# Altium project sensors_0v3.PrjPCB
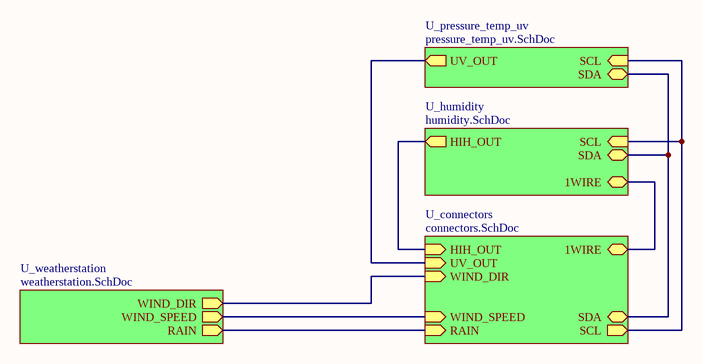
[diagram p0: main.SchDoc]
5 sheets, 69 parts. Net scope: hierarchical (ports join the sheet entries above them; power ports are global).
Board file: sensors_0v3.PcbDoc
Sheets:
  main.SchDoc
    U_connectors = connectors.SchDoc
    U_humidity = humidity.SchDoc
    U_pressure_temp_uv = pressure_temp_uv.SchDoc
    U_weatherstation = weatherstation.SchDoc

## Sheet main.SchDoc
size A4

### Sub-sheets
U_connectors = connectors.SchDoc: WIND_DIR (in), UV_OUT (in), HIH_OUT (in), WIND_SPEED (in), RAIN (in), SCL (out), SDA (bidir), 1WIRE (bidir)
U_humidity = humidity.SchDoc: HIH_OUT (out), SCL (in), SDA (bidir), 1WIRE (bidir)
U_pressure_temp_uv = pressure_temp_uv.SchDoc: UV_OUT (out), SCL (in), SDA (bidir)
U_weatherstation = weatherstation.SchDoc: RAIN (out), WIND_DIR (out), WIND_SPEED (out)

### Nets
1WIRE: sheet U_connectors/1WIRE, sheet U_humidity/1WIRE
SCL: sheet U_connectors/SCL, sheet U_humidity/SCL, sheet U_pressure_temp_uv/SCL
SDA: sheet U_connectors/SDA, sheet U_humidity/SDA, sheet U_pressure_temp_uv/SDA
NetC4_2: sheet U_connectors/HIH_OUT, sheet U_humidity/HIH_OUT
NetC12_2: sheet U_connectors/UV_OUT, sheet U_pressure_temp_uv/UV_OUT
NetC19_2: sheet U_connectors/RAIN, sheet U_weatherstation/RAIN
NetC20_2: sheet U_connectors/WIND_SPEED, sheet U_weatherstation/WIND_SPEED
NetC24_2: sheet U_connectors/WIND_DIR, sheet U_weatherstation/WIND_DIR

### Notes on the sheet
- Title
- Size:
- Date:
- A4
- Number:
- Time:
- Revision:
- Sheet
- of
- File:

## Sheet connectors.SchDoc
size A4
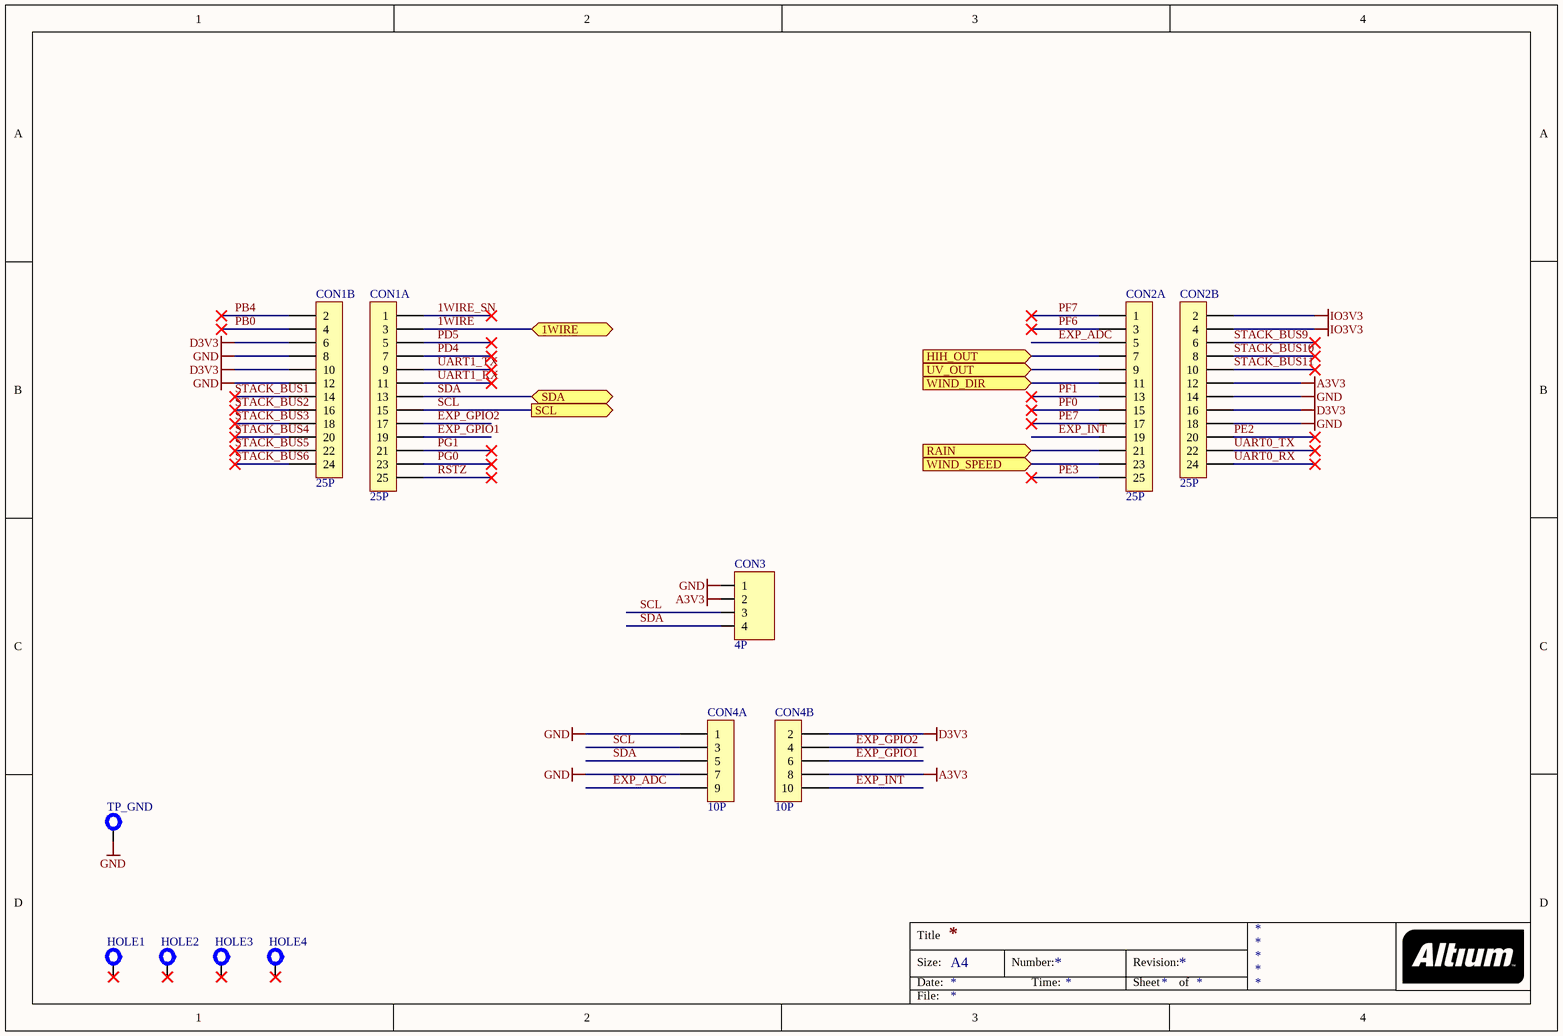
[diagram p1: connectors.SchDoc]

### Parts
CON1  25P  [DF9-25-STACK]  (parts A,B of 2)
CON2  25P  [DF9-25-STACK]  (parts A,B of 2)
CON3  4P  [SIP-4]
CON4  10P  [IDC-10]  (parts A,B of 2)
HOLE1  HOLE  [NPTH-3MM]  (value not drawn)  (no BOM)
HOLE2  HOLE  [NPTH-3MM]  (value not drawn)  (no BOM)
HOLE3  HOLE  [NPTH-3MM]  (value not drawn)  (no BOM)
HOLE4  HOLE  [NPTH-3MM]  (value not drawn)  (no BOM)
TP_GND  Test Point  [TEST-PROBE2]  (value not drawn)  (no BOM)

### Ports
1WIRE (bidir), HIH_OUT (in), RAIN (in), SCL (out), SDA (bidir), UV_OUT (in), WIND_DIR (in), WIND_SPEED (in)

### Nets
A3V3: CON2.12 CON3.2 CON4.8
D3V3: CON1.6 CON1.10 CON2.16 CON4.2
GND: CON1.8 CON1.12 CON2.14 CON2.18 CON3.1 CON4.1 CON4.7 TP_GND.1(TP)
IO3V3: CON2.2 CON2.4
1WIRE: CON1.3 ; port 1WIRE
1WIRE_SN: CON1.1
EXP_ADC: CON2.5 CON4.9
EXP_GPIO1: CON1.19 CON4.6
EXP_GPIO2: CON1.17 CON4.4
EXP_INT: CON2.19 CON4.10
PB0: CON1.4
PB4: CON1.2
PD4: CON1.7
PD5: CON1.5
PE2: CON2.20
PE3: CON2.25
PE7: CON2.17
PF0: CON2.15
PF1: CON2.13
PF6: CON2.3
PF7: CON2.1
PG0: CON1.23
PG1: CON1.21
RSTZ: CON1.25
SCL: CON1.15 CON3.3 CON4.3 ; port SCL
SDA: CON1.13 CON3.4 CON4.5 ; port SDA
STACK_BUS1: CON1.14
STACK_BUS2: CON1.16
STACK_BUS3: CON1.18
STACK_BUS4: CON1.20
STACK_BUS5: CON1.22
STACK_BUS6: CON1.24
STACK_BUS9: CON2.6
STACK_BUS10: CON2.8
STACK_BUS11: CON2.10
UART0_RX: CON2.24
UART0_TX: CON2.22
UART1_RX: CON1.11
UART1_TX: CON1.9
NetC4_2: CON2.7 ; port HIH_OUT
NetC12_2: CON2.9 ; port UV_OUT
NetC19_2: CON2.21 ; port RAIN
NetC20_2: CON2.23 ; port WIND_SPEED
NetC24_2: CON2.11 ; port WIND_DIR

Not connected (* = marked no-connect by the designer): HOLE1 1(TP)*; HOLE2 1(TP)*; HOLE3 1(TP)*; HOLE4 1(TP)*

### Notes on the sheet
- Title
- Size:
- Date:
- A4
- Number:
- Time:
- Revision:
- Sheet
- of
- File:

### Library data of the parts
CON1 CON2 = CON25: Connector 25 Pins; Owner: Ricardo Rodrigues; Assembly: INS; Sub-Type: Connector; Creation Date: 2013-01-13; Status: Valid; Validation Date: 2012-01-13; Type: Electrical & Mechanical
CON3 = CON04: Connector 4 pins; Owner: Rui Rebelo; Assembly: INS; Sub-Type: Connector; Creation Date: 2005-10-17; Status: Valid; Validation Date: 2006-05-15; Type: Electrical & Mechanical
CON4 = CON10: Connector 10 Pins; Owner: António Silva; Assembly: INS; Sub-Type: Connector; Creation Date: 2005-11-21; Status: Valid; Validation Date: 2006-05-15; Type: Electrical & Mechanical
HOLE1-HOLE4 = PCB HOLE: PCB Fixation Hole M3; Owner: Nuno Brum; Sub-Type: Mechanical; Type: PCB; Creation Date: 2005-06-01; Status: Valid; Validation Date: 2006-05-15; Assembly: PCB
TP_GND = TEST-PROBE: Test/Probe Point; Owner: Nuno Brum; Sub-Type: Mechanical; Assembly: PCB; Validation Date: 2006-05-15; Type: PCB; Creation Date: 2005-06-01; Status: Valid

## Sheet humidity.SchDoc: Humidity Sensors
size A4; CheckedBy: rrodrigu; Author: Satxo; CompanyName: Satxo; Revision: 0v1; SheetNumber: 4; SheetTotal: 8; ProjectName: Basestation
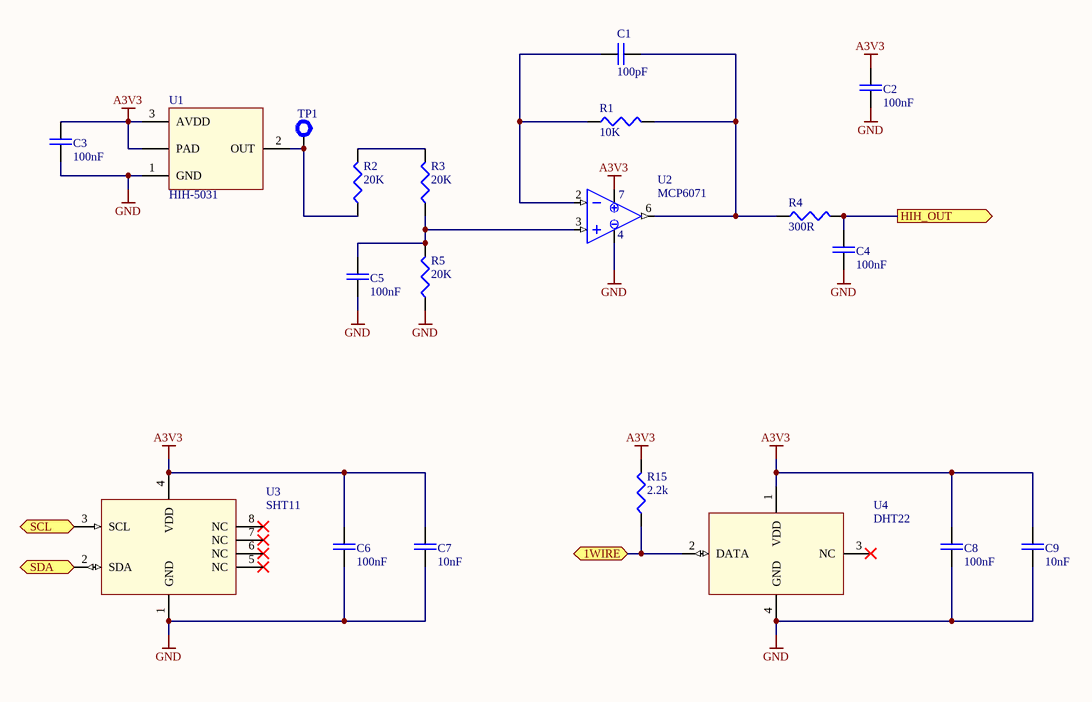
[diagram p2: humidity.SchDoc]

### Parts
C1  100pF  [0603]
C2  100nF  [0603]
C3  100nF  [0603]
C4  100nF  [0603]
C5  100nF  [0603]
C6  100nF  [0603]
C7  10nF  [0603]
C8  100nF  [0603]
C9  10nF  [0603]
R1  10K  [0603]
R2  20K  [0603]
R3  20K  [0603]
R4  300R  [0603]
R5  20K  [0603]
R15  2.2k  [0603]
TP1  Test Point  [TERMINAL]  (value not drawn)  (no BOM)
U1  HIH-5031  [HIH]
U2  MCP6071  [SOIC-8]
U3  SHT11  [SHT]
U4  DHT22  [DHT22]

### Ports
1WIRE (bidir), HIH_OUT (out), SCL (in), SDA (bidir)

### Nets
A3V3: C2.2 C3.2 C6.2 C7.2 C8.2 C9.2 R15.2 U1.3(AVDD) U1.PAD U2.7(VDD) U3.4(VDD) U4.1(VDD)
GND: C2.1 C3.1 C4.1 C5.1 C6.1 C7.1 C8.1 C9.1 R5.1 U1.1(GND) U2.4(VSS) U3.1(GND) U4.4(GND)
1WIRE: R15.1 U4.2(DATA) ; port 1WIRE
SCL: U3.3(SCL) ; port SCL
SDA: U3.2(SDA) ; port SDA
NetC1_1: C1.1 R1.1 U2.2(INN)
NetC1_2: C1.2 R1.2 R4.1 U2.6(VOUT)
NetC4_2: C4.2 R4.2 ; port HIH_OUT
NetC5_2: C5.2 R3.1 R5.2 U2.3(INP)
NetR2_1: R2.1 TP1.1(TP) U1.2(OUT)
NetR2_2: R2.2 R3.2

Not connected (* = marked no-connect by the designer): U3 5(NC)* 6(NC)* 7(NC)* 8(NC)*; U4 3(NC)*

### Notes on the sheet
- Title
- Size:
- Date:
- A4
- Number:
- Time:
- Revision:
- Sheet
- of
- File:

### Library data of the parts
C1-C9 = CAP: Capacitor; Owner: Nuno Brum; Sub-Type: Ceramic; Assembly: INS; Maximum Voltage: *; Creation Date: 2005-04-28; Status: Valid; Validation date: 2006-05-15; Type: Capacitor
R1-R5 R15 = RES: Resistor; Owner: Nuno Brum; Sub-Type: Generic; Assembly: INS; Validation date: 2006-05-15; Creation Date: 2002-07-17; Status: Valid; Power: *; Type: Resistor
TP1 = TEST-PROBE: as TP_GND on sheet connectors; Validation Date: 2006-05-15; Type: PCB; Creation Date: 2005-06-01; Status: Valid
U1 = HIH-5031: Low Voltage Humidity Sensor; Type: IC; Creation Date: 2012-03-05
U2 = MCP6V26: Low-Offset Opamp; Type: IC; Creation Date: 2012-03-15
U3 = SHT11: Digital Humidity and Temperature Sensor; Type: IC; Creation Date: 2012-12-08
U4 = DHT22: Digital Humidity and Temperature Sensor; Type: IC; Creation Date: 2012-12-09

## Sheet pressure_temp_uv.SchDoc: UV Sensor
size A4; CheckedBy: rrodrigu; Author: Satxo; CompanyName: Satxo; Revision: 0v1; SheetNumber: 7; SheetTotal: 8; ProjectName: Basestation
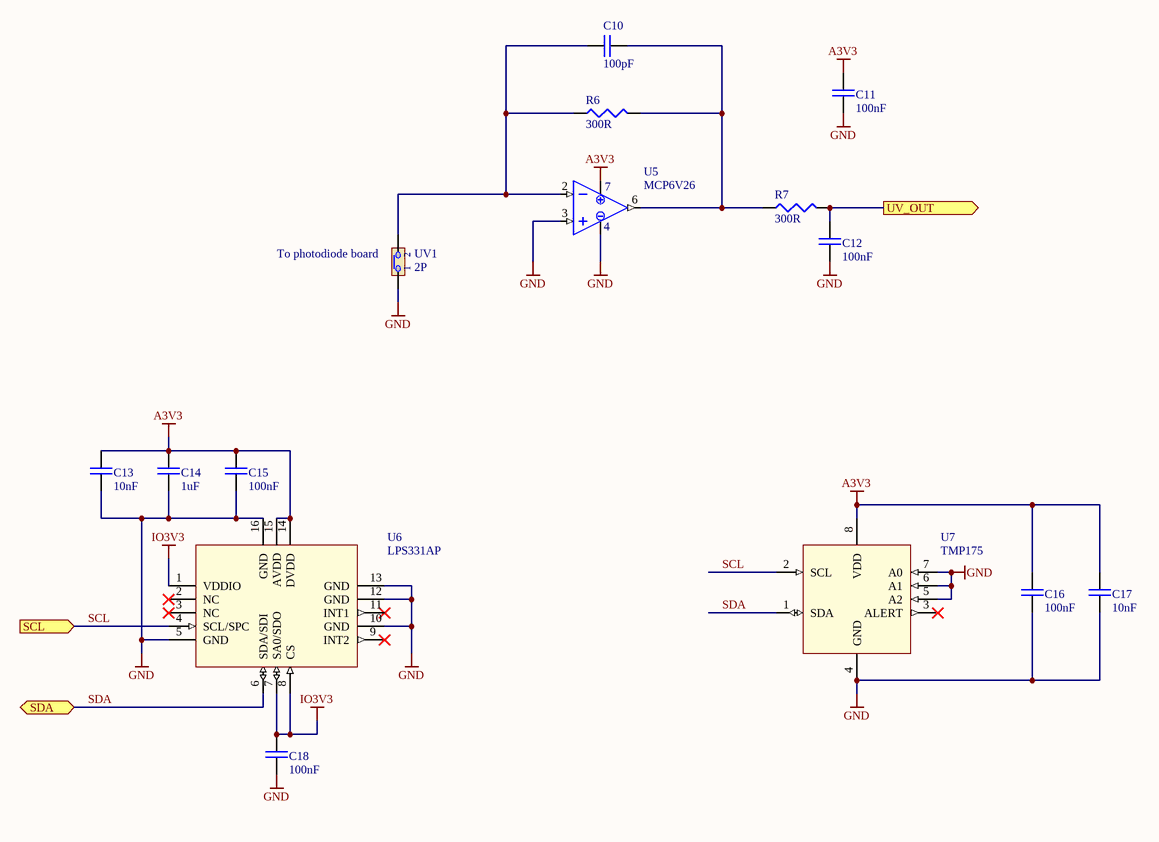
[diagram p3: pressure_temp_uv.SchDoc]

### Parts
C10  100pF  [0603]
C11  100nF  [0603]
C12  100nF  [0603]
C13  10nF  [0603]
C14  1uF  [0603]
C15  100nF  [0603]
C16  100nF  [0603]
C17  10nF  [0603]
C18  100nF  [0603]
R6  300R  [0603]
R7  300R  [0603]
U5  MCP6V26  [SOIC-8]
U6  LPS331AP  [HCLGA-16]
U7  TMP175  [SOIC-8]
UV1  2P  [SIP-2]

### Ports
SCL (in), SDA (bidir), UV_OUT (out)

### Nets
A3V3: C11.2 C13.2 C14.2 C15.2 C16.2 C17.2 U5.7(VDD) U6.14(DVDD) U6.15(AVDD) U7.8(VDD)
GND: C11.1 C12.1 C13.1 C14.1 C15.1 C16.1 C17.1 C18.1 U5.3(INP) U5.4(VSS) U6.5(GND) U6.10(GND) U6.12(GND) U6.13(GND) U6.16(GND) U7.4(GND) U7.5(A2) U7.6(A1) U7.7(A0) UV1.1
IO3V3: C18.2 U6.1(VDDIO) U6.7(SA0/SDO) U6.8(CS)
SCL: U6.4(SCL/SPC) U7.2(SCL) ; port SCL
SDA: U6.6(SDA/SDI) U7.1(SDA) ; port SDA
NetC10_1: C10.1 R6.1 U5.2(INN) UV1.2
NetC10_2: C10.2 R6.2 R7.1 U5.6(VOUT)
NetC12_2: C12.2 R7.2 ; port UV_OUT

Not connected (* = marked no-connect by the designer): U6 2(NC)* 3(NC)* 9(INT2)* 11(INT1)*; U7 3(ALERT)*

### Notes on the sheet
- (near UV1) To photodiode board
- Title
- Size:
- Date:
- A4
- Number:
- Time:
- Revision:
- Sheet
- of
- File:

### Library data of the parts
C10-C18 = CAP: as C1 on sheet humidity; Maximum Voltage: *; Creation Date: 2005-04-28; Status: Valid; Validation date: 2006-05-15; Type: Capacitor
R6 R7 = RES: as R1 on sheet humidity; Validation date: 2006-05-15; Creation Date: 2002-07-17; Status: Valid; Power: *; Type: Resistor
U5 = MCP6V26: Low-Offset Opamp; Type: IC; Creation Date: 2012-03-15
U6 = LPS331AP: Pressure sensor, 260 - 1260 mbar; Creation Date: 2012-12-06; Type: IC
U7 = TMP175: Digital Temperature Sensor; Type: IC; Creation Date: 2012-03-05
UV1 = JMP2: 2-pin Jumper; Owner: Nuno Brum; Sub-Type: Connector; STATE1: 1; Assembly: INS; Validation Date: 2006-05-15; Creation Date: 2002-07-17; Status: Valid; Type: Electrical & Mechanical

## Sheet weatherstation.SchDoc: Weather Station
size A4; CheckedBy: rrodrigu; Author: Satxo; CompanyName: Satxo; Revision: 0v1; SheetNumber: 8; SheetTotal: 8; ProjectName: Basestation
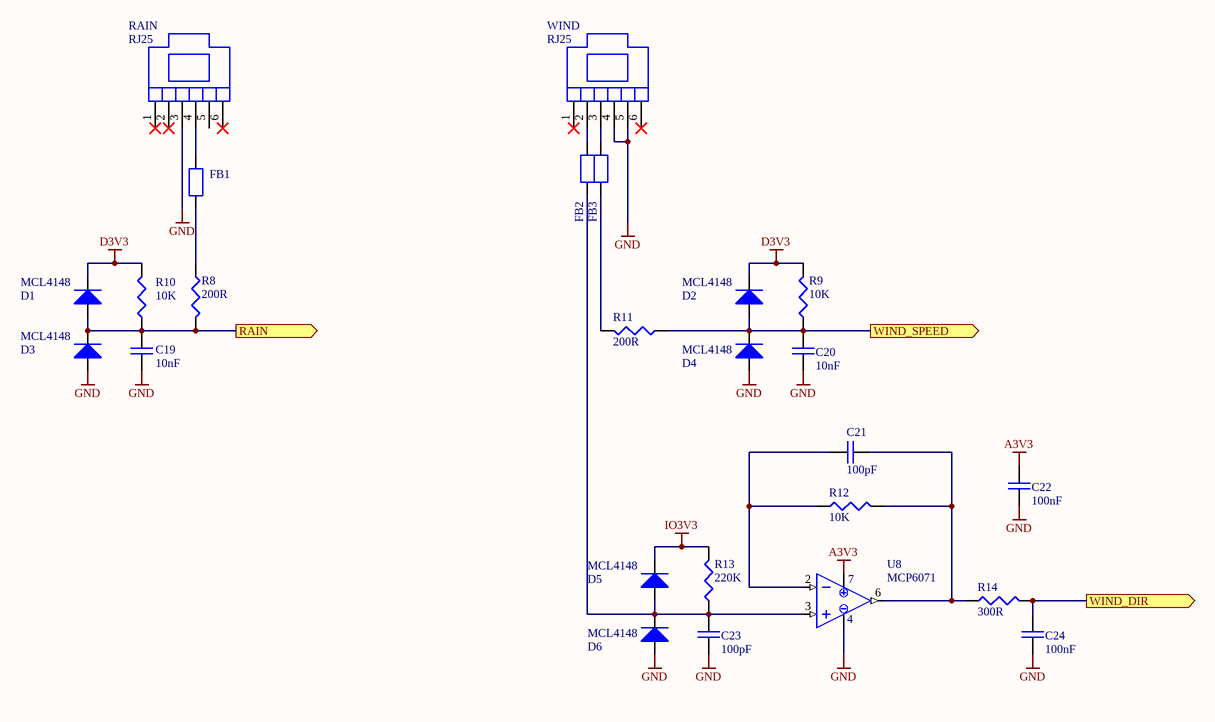
[diagram p4: weatherstation.SchDoc]

### Parts
C19  10nF  [0603]
C20  10nF  [0603]
C21  100pF  [0603]
C22  100nF  [0603]
C23  100pF  [0603]
C24  100nF  [0603]
D1  MCL4148  [0805@DIODE]
D2  MCL4148  [0805@DIODE]
D3  MCL4148  [0805@DIODE]
D4  MCL4148  [0805@DIODE]
D5  MCL4148  [0805@DIODE]
D6  MCL4148  [0805@DIODE]
FB1  150Z_100MHz  [0805]  (value not drawn)
FB2  150Z_100MHz  [0805]  (value not drawn)
FB3  150Z_100MHz  [0805]  (value not drawn)
R8  200R  [0603]
R9  10K  [0603]
R10  10K  [0603]
R11  200R  [0603]
R12  10K  [0603]
R13  220K  [0603]
R14  300R  [0603]
RAIN  RJ25  [RJ25]
U8  MCP6071  [SOIC-8]
WIND  RJ25  [RJ25]

### Ports
RAIN (out), WIND_DIR (out), WIND_SPEED (out)

### Nets
A3V3: C22.2 U8.7(VDD)
D3V3: D1.K D2.K R9.2 R10.2
GND: C19.1 C20.1 C22.1 C23.1 C24.1 D3.A D4.A D6.A RAIN.3 U8.4(VSS) WIND.4 WIND.5
IO3V3: D5.K R13.2
NetC19_2: C19.2 D1.A D3.K R8.2 R10.1 ; port RAIN
NetC20_2: C20.2 D2.A D4.K R9.1 R11.1 ; port WIND_SPEED
NetC21_1: C21.1 R12.1 U8.2(INN)
NetC21_2: C21.2 R12.2 R14.1 U8.6(VOUT)
NetC23_2: C23.2 D5.A D6.K FB2.2 R13.1 U8.3(INP)
NetC24_2: C24.2 R14.2 ; port WIND_DIR
NetFB1_1: FB1.1 R8.1
NetFB1_2: FB1.2 RAIN.4
NetFB2_1: FB2.1 WIND.2
NetFB3_1: FB3.1 WIND.3
NetFB3_2: FB3.2 R11.2

Not connected (* = marked no-connect by the designer): RAIN 1* 2* 5 6*; WIND 1* 6*

### Notes on the sheet
- Title
- Size:
- Date:
- A4
- Number:
- Time:
- Revision:
- Sheet
- of
- File:

### Library data of the parts
C19-C24 = CAP: as C1 on sheet humidity; Maximum Voltage: *; Creation Date: 2005-04-28; Status: Valid; Validation date: 2006-05-15; Type: Capacitor
D1-D6 = Diode: Vishay Standard Avalanche Sinterglass Diode; Owner: Nuno Brum; Sub-Type: Generic; Assembly: INS; Validation date: 2006-05-15; Creation Date: 2001-06-05; Status: Valid; Model: MCL4148; Type: Diode
FB1-FB3 = FERRITE-BEAD-AXIAL: Ferrite bead; Sub-Type: Filter; Owner: Sergio Pires; Type: Electrical & Mechanical; Assembly: INS; Creation Date: 2005-10-20; Status: New
R8-R14 = RES: as R1 on sheet humidity; Validation date: 2006-05-15; Creation Date: 2002-07-17; Status: Valid; Power: *; Type: Resistor
RAIN WIND = RJ25: RJ25 Connector; Type: Connector; Creation Date: 2012-03-26
U8 = MCP6V26: Low-Offset Opamp; Type: IC; Creation Date: 2012-03-15

## Nets that join several sheets
A3V3: connectors (CON2.12 CON3.2 CON4.8), humidity (12 pins), pressure_temp_uv (10 pins), weatherstation (C22.2 U8.7)
D3V3: connectors (CON1.6 CON1.10 CON2.16 CON4.2), weatherstation (D1.K D2.K R9.2 R10.2)
GND: connectors (8 pins), humidity (13 pins), pressure_temp_uv (20 pins), weatherstation (12 pins)
IO3V3: connectors (CON2.2 CON2.4), pressure_temp_uv (C18.2 U6.1 U6.7 U6.8), weatherstation (D5.K R13.2)
1WIRE: connectors (CON1.3), humidity (R15.1 U4.2)
NetC4_2: connectors (CON2.7), humidity (C4.2 R4.2)
NetC12_2: connectors (CON2.9), pressure_temp_uv (C12.2 R7.2)
NetC19_2: connectors (CON2.21), weatherstation (5 pins)
NetC20_2: connectors (CON2.23), weatherstation (5 pins)
NetC24_2: connectors (CON2.11), weatherstation (C24.2 R14.2)
SCL: connectors (CON1.15 CON3.3 CON4.3), humidity (U3.3), pressure_temp_uv (U6.4 U7.2)
SDA: connectors (CON1.13 CON3.4 CON4.5), humidity (U3.2), pressure_temp_uv (U6.6 U7.1)